# EAGLE design G1-6 (EAGLE 7.6.0)
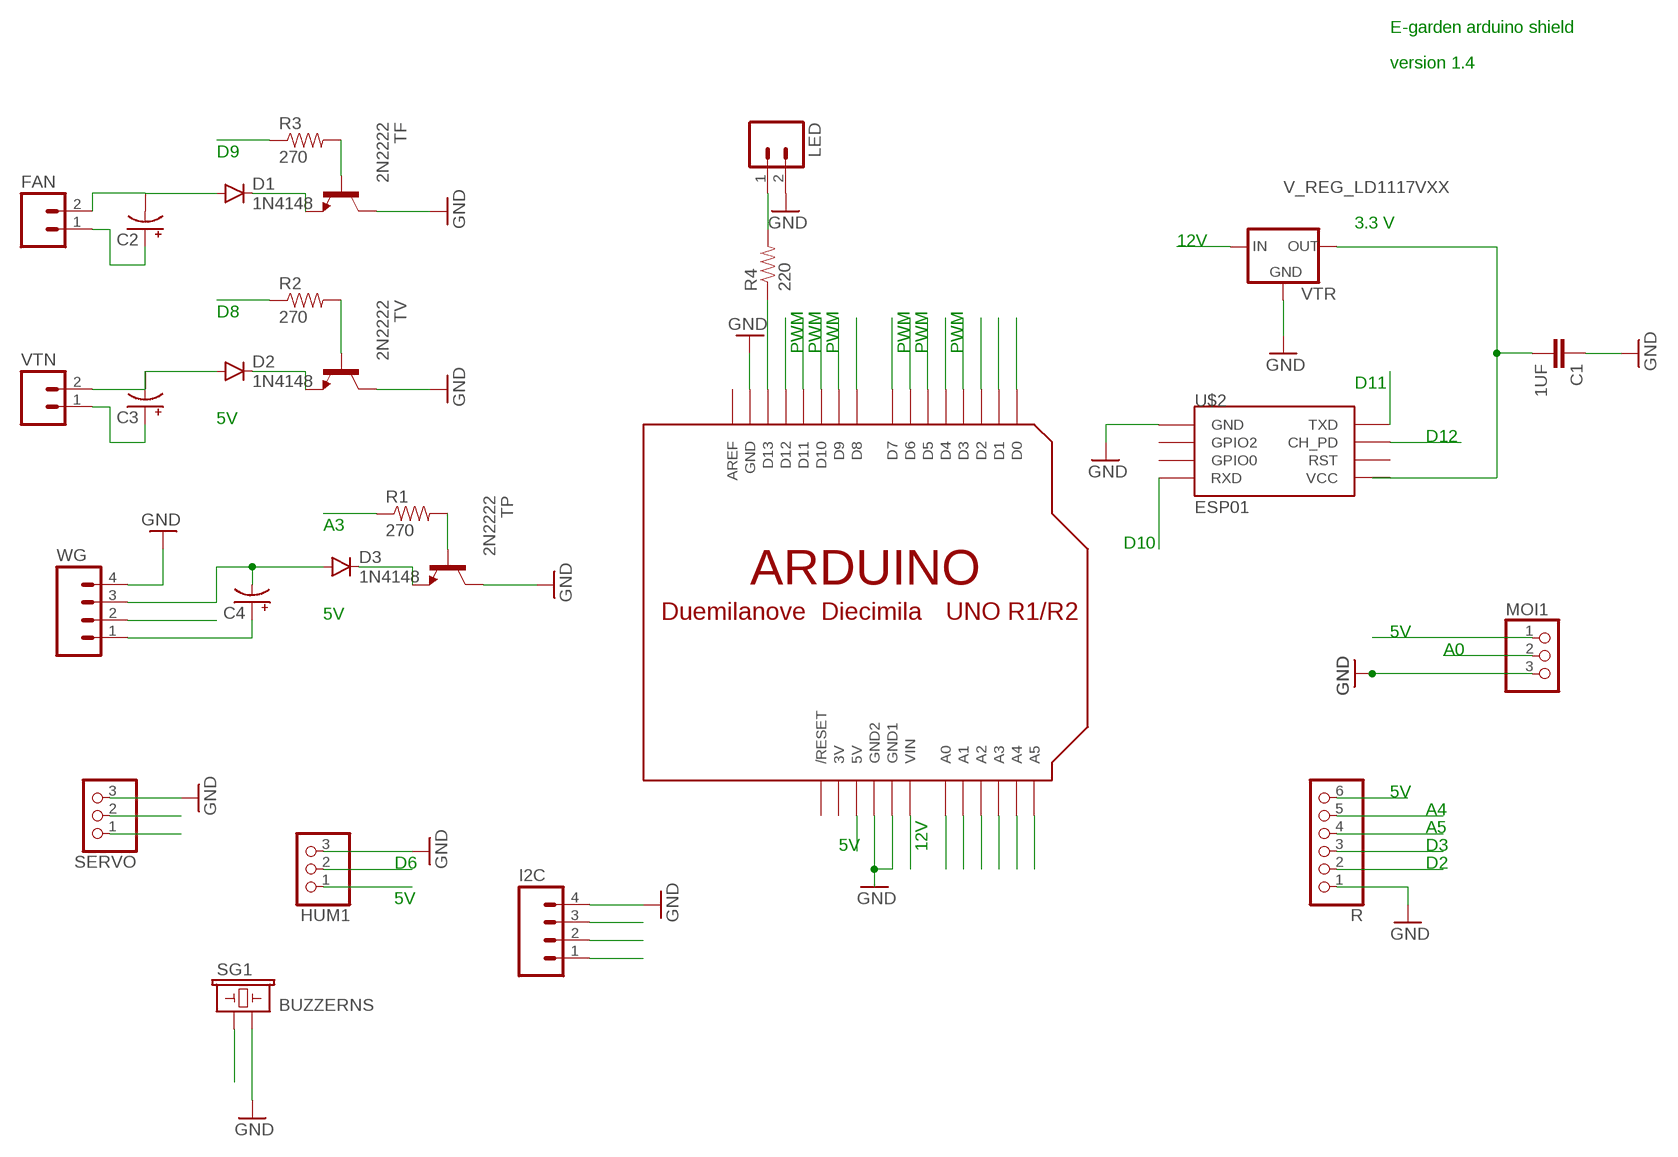
[diagram p0: schematic, sheet 1]

## Parts
C1  1UF  CAPKIT  [CAP-PTH-SMALL-KIT]
C2  CAP_POLPTH2  [CPOL-RADIAL-10UF-25V]
C3  CAP_POLPTH2  [CPOL-RADIAL-10UF-25V]
C4  CAP_POLPTH2  [CPOL-RADIAL-10UF-25V]
D1  1N4148  DIODE1N4148  [DIODE-1N4148]
D2  1N4148  DIODE1N4148  [DIODE-1N4148]
D3  1N4148  DIODE1N4148  [DIODE-1N4148]
FAN  M02PTH  [1X02]
HUM1  PINHD-1X3CB  [1X03-CLEANBIG]
I2C  M04NO_SILK_ALL_ROUND  [1X04_NO_SILK_ALL_ROUND]
LED  M02PTH  [1X02]
MOI1  PINHD-1X3CB  [1X03-CLEANBIG]
R  PINHD-1X6CB  [1X06-CLEANBIG]
R1  270  RESISTORPTH-1/4W  [AXIAL-0.4]
R2  270  RESISTORPTH-1/4W  [AXIAL-0.4]
R3  270  RESISTORPTH-1/4W  [AXIAL-0.4]
R4  220  RESISTORPTH-1/4W  [AXIAL-0.4]
SERVO  PINHD-1X3CB  [1X03-CLEANBIG]
SG1  BUZZERNS  [BUZZER-12MM-NS]
TF  2N2222  [TO92-EBC-OVAL]
TP  2N2222  [TO92-EBC-OVAL]
TV  2N2222  [TO92-EBC-OVAL]
U$1  ARDUINO-BPLACE  [ARDUINO-BPLACE]
U$2  ESP01  [ESP01]
VTN  M02PTH  [1X02]
VTR  V_REG_LD1117VXX  [78XXL]
WG  M04NO_SILK_ALL_ROUND  [1X04_NO_SILK_ALL_ROUND]

## Nets
A0: MOI1.2 U$1.A0
A1: U$1.A1 WG.2
A2: R.4 U$1.A2
A3: R.5 U$1.A3
A4: I2C.3 U$1.A4
A5: I2C.2 U$1.A5
D0: U$1.D0
D1: U$1.D1
D2: R.3 U$1.D2
D3: R.2 U$1.D3
D4: SERVO.2 U$1.D4
D5: SG1.+ U$1.D5
D6: HUM1.2 U$1.D6
D7: R1.P$1 U$1.D7
D8: R2.P$1 U$1.D8
D9: R3.P$1 U$1.D9
D10: U$1.D10 U$2.RX(RXD)
D11: U$1.D11 U$2.TX(TXD)
D12: U$1.D12 U$2.CH_PD
D13: R4.P$1 U$1.D13
GND: C1.1 HUM1.3 I2C.4 LED.2 MOI1.3 R.1 SERVO.3 SG1.- TF.C TP.C TV.C U$1.GND U$1.GND1 U$1.GND2 U$2.GND VTR.IN(GND) WG.4
N$1: D1.C TF.E
N$2: LED.1 R4.P$2
N$3: D2.C TV.E
N$4: D3.C TP.E
N$5: R3.P$2 TF.B
N$6: C3.2(-) D2.A VTN.2
N$7: R1.P$2 TP.B
N$8: C1.2 U$2.VCC VTR.GND(OUT)
N$9: C2.2(-) D1.A FAN.2
N$10: C4.2(-) D3.A WG.3
TV: R2.P$2 TV.B
V5: C2.1(+) C3.1(+) C4.1(+) FAN.1 HUM1.1 I2C.1 MOI1.1 R.6 SERVO.1 U$1.5V VTN.1 WG.1
V12: U$1.VIN VTR.OUT(IN)
Unconnected: U$1.AREF U$1.RESET(/RESET) U$2.GPIO0 U$2.GPIO2 U$2.RST

## Notes on the sheet
- E-garden arduino shield
- version 1.4
- D9
- 3.3 V
- 12V
- D8
- PWM | PWM | PWM | PWM | PWM | PWM
- D11
- 5V
- D12
- A3
- D10
- 5V
- 5V
- A0
- 5V
- A4
- A5
- 5V | 12V | D3
- D6 | D2
- 5V

## Power pins joined to a net without a drawn wire
3V: U$1.3V

## Library data of the parts
C1 = SparkFun-Capacitors:CAP: Capacitor Standard 0603 ceramic capacitor, and 0.1" leaded capacitor.
C2-C4 = SparkFun-Passives:CAP_POL: Capacitor Polarized These are standard SMD and PTH capacitors. Normally 10uF, 47uF, and 100uF in electrolytic and tantalum varieties. Always verify the external diameter of the through hole cap, it varies with capacity, voltage, and manufacturer. The EIA devices should be standard.
D1-D3 = SparkFun-DiscreteSemi:DIODE: Diode These are standard reverse protection diodes and small signal diodes. SMA package can handle up to about 1A. SOD-323 can handle about 200mA. What the SOD-323 package when ordering, there are some mfgs out there that are 5-pin packages.; PROD_ID: DIO-08378
FAN LED VTN = SparkFun-Connectors:M02: Standard 2-pin 0.1" header. Use with - straight break away headers ( PRT-00116) - right angle break away headers (PRT-00553) - swiss pins (PRT-00743) - machine pins (PRT-00117) - female headers (PRT-00115) Molex polarized connector foot print use with: PRT-08233 with associated crimp pins and housings. 2.54_SCREWTERM for use with PRT-10571. 3.5mm Screw Terminal footprints for PRT-08084 5mm Screw Terminal footprints for use with PRT-08432
HUM1 MOI1 SERVO = adafruit:PINHD-1X3: PIN HEADER
I2C WG = SparkFun-Connectors:M04: Header 4 Standard 4-pin 0.1" header. Use with straight break away headers (SKU : PRT-00116), right angle break away headers (PRT-00553), swiss pins (PRT-00743), machine pins (PRT-00117), and female headers (PRT-00115). Molex polarized connector foot print use with SKU : PRT-08231 with associated crimp pins and housings. 1MM SMD Version SKU: PRT-10208; PROD_ID: CONN-09696
R = adafruit:PINHD-1X6: PIN HEADER
R1-R4 = SparkFun-Passives:RESISTOR: Resistor Basic schematic elements and footprints for 0603, 1206, and PTH resistors.
SG1 = SparkFun-Electromechanical:BUZZER: Buzzer 12mm Spark Fun Electronics SKU : Comp-Buzzer
TF TP TV = adafruit:2N2222: NPN TRANSISTOR Big oval pads
U$1 = adafruit:ARDUINO: Arduino Diecimila/Duemilanove Make a shield with ease, this package has all the named pins as well as the two mounting drill holes and an outline of the USB and DC power connector. The outline is on the DIMENSION layer, so if your board house uses it they will cut the outline to match. http://www.ladyada.net/library/pcb/eaglelibrary.html
U$2 = esp8266modules:ESP01: ESP8266 Wifi module 01
VTR = SparkFun-PowerIC:V_REG_LD1117VXX: LD1117VXX voltage regulator. We carry the 3.3V version (COM-00526) in TO-220 package.

## Board
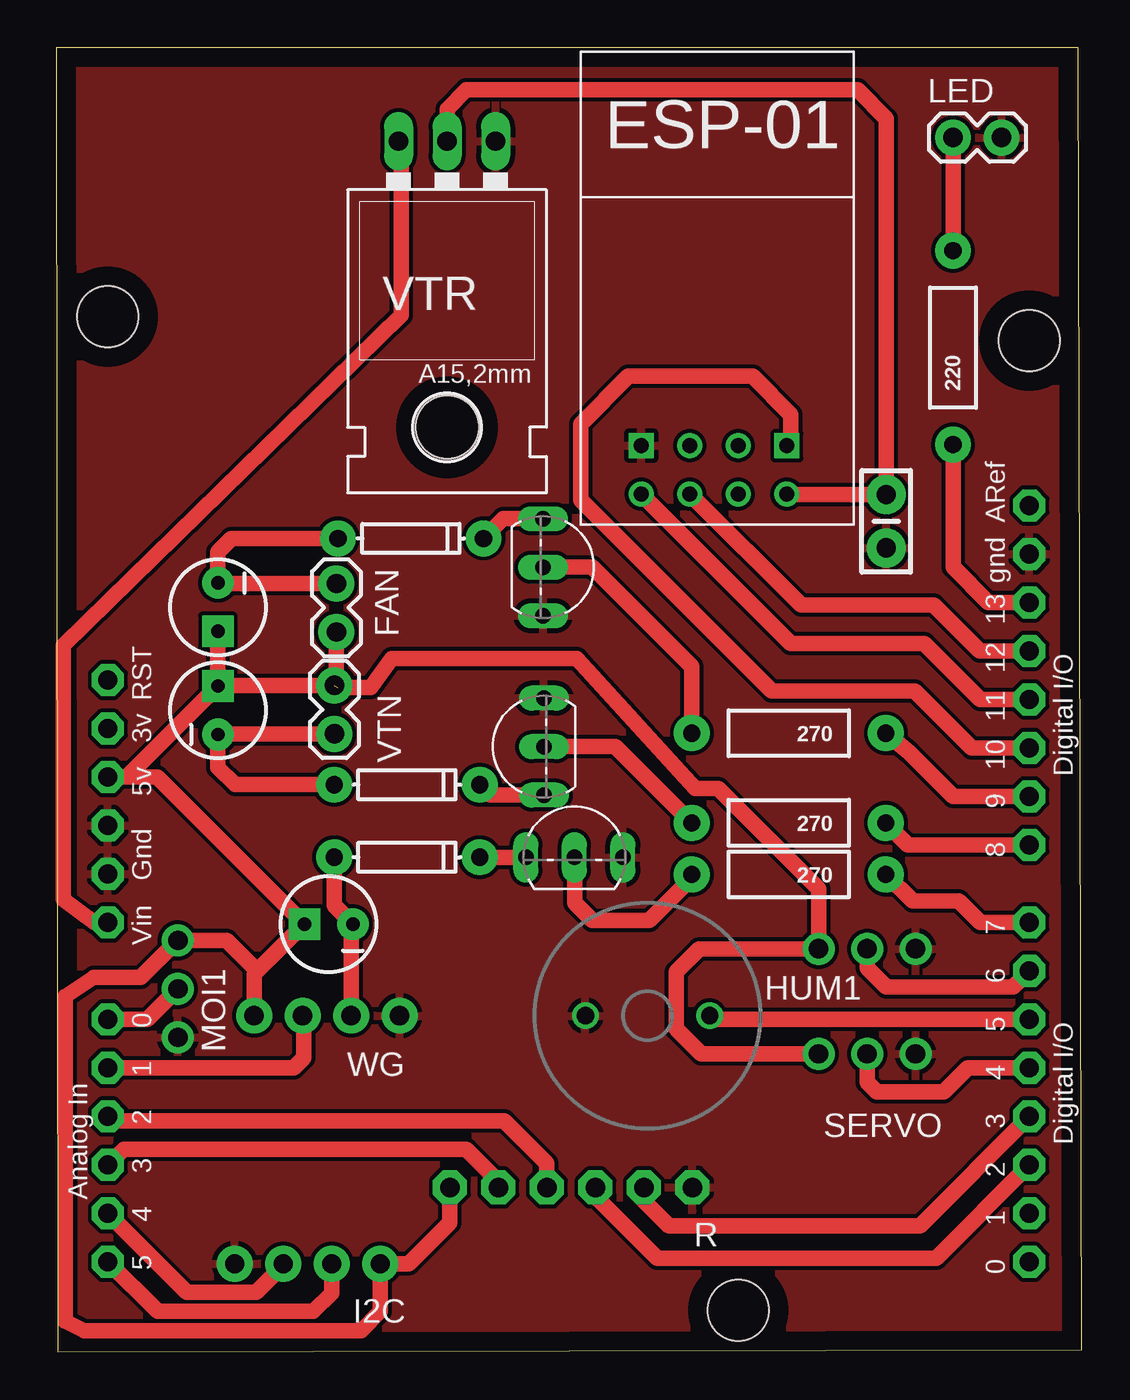
[diagram p1: board, top side]
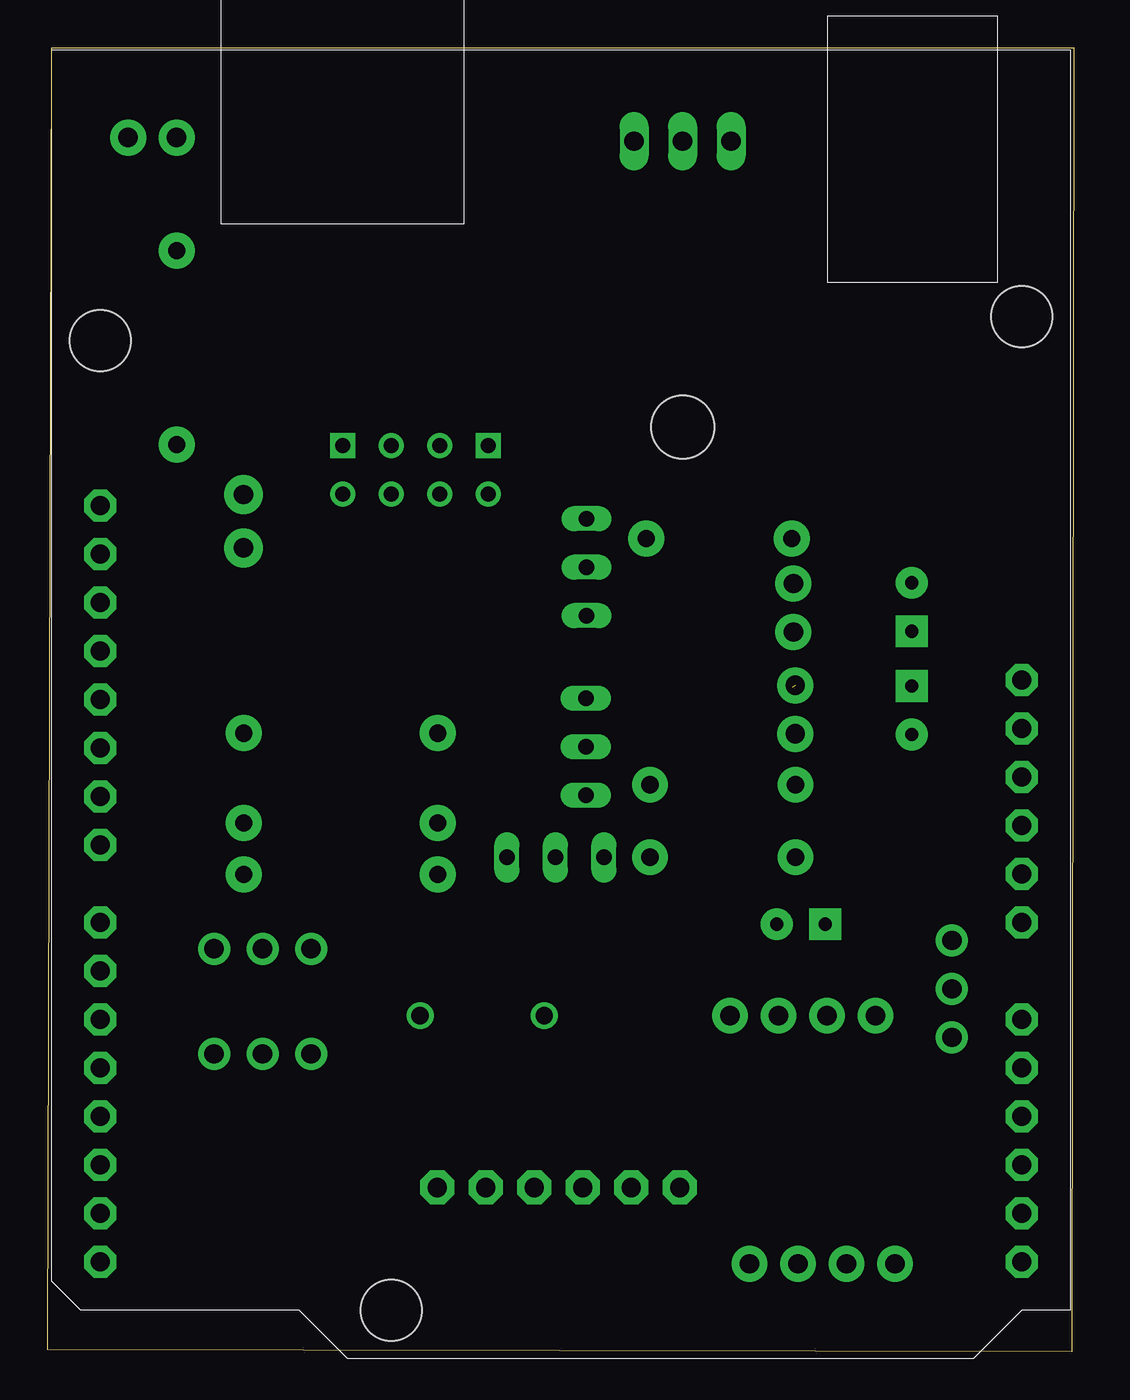
[diagram p2: board, bottom side, seen from below]

Size 53.73 x 68.32 mm. Coordinates in mm from the lower left corner, seen from the top.
Outline: 0.1,0 53.73,0.1 53.53,68.32 0,68.32 0.1,0
Copper layers (1*16): Top 0.035mm / dielectric 1.5mm / Bottom 0.035mm
Design rules "default": minimum track width 10mil, minimum drill 24mil, track to track 8mil, track to pad 8mil, pad to pad 8mil, via to via 8mil, smd to smd 8mil, copper to edge 40mil, drill to drill 8mil, minimum pad ring 10mil, minimum via ring 8mil, stop-mask expansion 4mil, vias tented up to drill 0mil, thermal gap 10mil

### Footprints (pad centres in the part's own frame; a part is rotated, then mirrored left to right if it is on the bottom)
CAP-PTH-SMALL-KIT = drill 1.016 pad 2.032: 1 -1.397,0; 2 1.397,0
CPOL-RADIAL-10UF-25V = drill 0.7 pad 1.651 square: 1 1.27,0 | drill 0.7 pad 1.651: 2 -1.27,0
DIODE-1N4148 = drill 0.9 pad 1.88: A -3.81,0; C 3.81,0
1X02 = drill 1.016 pad 1.88: 1 0,0; 2 2.54,0
1X03-CLEANBIG = drill 1.016 pad 1.676: 1 -2.54,0; 2 0,0; 3 2.54,0
1X04_NO_SILK_ALL_ROUND = drill 1.016 pad 1.88: 1 0,0; 2 2.54,0; 3 5.08,0; 4 7.62,0
1X06-CLEANBIG = drill 1.016 pad 1.778 octagon: 1 -6.35,0; 2 -3.81,0; 3 -1.27,0; 4 1.27,0; 5 3.81,0; 6 6.35,0
AXIAL-0.4 = drill 0.9 pad 1.88: P$1 -5.08,0; P$2 5.08,0
BUZZER-12MM-NS = drill 0.9: + 3.25,0; - -3.25,0
TO92-EBC-OVAL = drill 0.813 long: B 0,-1.27; C 2.54,-1.27; E -2.54,-1.27
ARDUINO-BPLACE = drill 1 pad 1.676 octagon: 3V 35.56,2.54; 5V 38.1,2.54; A0 50.8,2.54; A1 53.34,2.54; A2 55.88,2.54; A3 58.42,2.54; A4 60.96,2.54; A5 63.5,2.54; AREF 23.876,50.8; D0 63.5,50.8; D1 60.96,50.8; D2 58.42,50.8; D3 55.88,50.8; D4 53.34,50.8; D5 50.8,50.8; D6 48.26,50.8; D7 45.72,50.8; D8 41.656,50.8; D9 39.116,50.8; D10 36.576,50.8; D11 34.036,50.8; D12 31.496,50.8; D13 28.956,50.8; GND 26.416,50.8; GND1 43.18,2.54; GND2 40.64,2.54; RESET 33.02,2.54; VIN 45.72,2.54 | hole 3.2: 15.24,50.8; 66.04,35.56; 13.97,2.54
ESP01 = drill 0.8: CH_PD -1.285,-8.178; GPIO0 1.255,-5.638; GPIO2 -1.285,-5.638; RST 1.255,-8.178; TX -3.825,-8.178; VCC 3.795,-8.178 | drill 0.8 square: GND -3.825,-5.638; RX 3.795,-5.638
78XXL = drill 1.016 long: GND 0,-3.81; IN -2.54,-3.81; OUT 2.54,-3.81 | hole 3.302: 0,11.176

### Placement (x,y rotation side)
C1  43.48,43.51 90 top
C2  8.48,39.01 270 top
C3  8.48,33.61 90 top
C4  14.28,22.41 180 top
D1  18.58,42.61 0 top
D2  18.38,29.71 0 top
D3  18.38,25.91 0 top
FAN  14.68,37.71 90 top
HUM1  42.48,21.11 0 top
I2C  16.98,4.61 180 top
LED  46.98,63.61 0 top
MOI1  6.38,19.01 270 top
R  26.98,8.61 180 top
R1  38.38,25.01 180 top
R2  38.38,27.71 180 top
R3  38.38,32.41 180 top
R4  46.98,52.61 90 top
SERVO  42.48,15.61 0 top
SG1  30.98,17.61 0 top
TF  26.78,41.11 270 top
TP  27.15,27.17 0 top
TV  24.28,31.71 90 top
U$1  0.18,68.21 270 top
U$2  34.48,53.11 0 top
VTN  14.58,34.91 270 top
VTR  20.48,59.61 180 top
WG  10.38,17.61 0 top

### Tracks (layer width: path | path; a pad name or v marks a point on that pad's centre or on a via)
A0
  Top 0.813: U$1.A0 4.78,17.41 MOI1.2
A1
  Top 0.813: U$1.A1 12.44,14.87 12.98,15.41 12.98,17.55 WG.2
A2
  Top 0.813: U$1.A2 2.94,12.11 23.48,12.11 25.71,9.88 R.4
A3
  Top 0.813: U$1.A3 3.54,10.61 21.48,10.61 23.17,8.92 R.5
A4
  Top 0.813: U$1.A4 6.86,3.11 10.48,3.11 11.9,4.53 I2C.3
A5
  Top 0.813: U$1.A5 5.32,2.11 13.48,2.11 14.44,3.07 I2C.2
D2
  Top 0.813: U$1.D2 46.1,4.91 31.48,4.91 28.25,8.14 R.3
D3
  Top 0.813: U$1.D3 45.26,6.61 32.08,6.61 30.79,7.9 R.2
D4
  Top 0.813: U$1.D4 47.74,14.87 46.48,13.61 42.98,13.61 42.48,14.11 SERVO.2
D5
  Top 0.813: U$1.D5 34.23,17.41 SG1.+
D6
  Top 0.813: U$1.D6 50.14,19.11 43.48,19.11 42.48,20.11 HUM1.2
D7
  Top 0.813: U$1.D7 48.4,22.49 47.28,23.61 44.86,23.61 R1.P$1
D8
  Top 0.813: U$1.D8 44.62,26.55 R2.P$1
D9
  Top 0.813: U$1.D9 47,29.09 44.68,31.41 R3.P$1
D10
  Top 0.813: U$1.D10 47.96,31.63 44.98,34.61 37.48,34.61 27.48,44.61 27.48,48.61 29.98,51.11 36.48,51.11 38.48,49.11 38.48,47.68 U$2.RX
D11
  Top 0.813: U$1.D11 48.42,34.17 45.48,37.11 38.48,37.11 U$2.TX
D12
  Top 0.813: U$1.D12 48.38,36.71 45.98,39.11 39.02,39.11 U$2.CH_PD
D13
  Top 0.813: U$1.D13 48.84,39.25 46.98,41.11 R4.P$1
GND
  pour Top: 0.18,68.11 53.68,68.21 53.68,0.11 0.08,0.11
N$1
  Top 0.813: TF.E 23.43,43.65 D1.C
N$2
  Top 0.813: R4.P$2 LED.1
N$3
  Top 0.813: TV.E 22.73,29.17 D2.C
N$4
  Top 0.813: TP.E 23.58,25.9 D3.C
N$5
  Top 0.813: R3.P$2 33.3,35.89 28.08,41.11 TF.B
N$6
  Top 0.813: VTN.2 8.51,32.37 C3.2 8.48,30.61 9.38,29.71 D2.A
N$7
  Top 0.813: R1.P$2 33.3,24.83 31.08,22.61 28.08,22.61 27.18,23.51 27.18,25.87 TP.B
N$8
  Top 0.813: VTR.GND 20.48,65.11 21.48,66.11 41.98,66.11 43.48,64.61 C1.2 38.3,44.91 U$2.VCC
N$9
  Top 0.813: 14.77,40.34 FAN.2 8.51,40.25 C2.2 8.48,41.91 9.18,42.61 D1.A
N$10
  Top 0.813: WG.3 15.46,22.32 C4.2 14.57,23.39 D3.A
TV
  Top 0.813: R2.P$2 29.3,31.71 TV.B
V5  (1 unrouted)
  Top 0.813: R.6 20.63,6.76 18.48,4.61 I2C.1 16.98,2.11 15.98,1.11 1.48,1.11 0.48,1.61 0.48,18.61 1.98,19.61 4.44,19.61 MOI1.1 8.94,21.55 10.54,19.95 | 2.72,30.35 U$1.5V | WG.1 10.38,19.78 10.54,19.95 | 10.54,19.95 C4.1 5.31,30.11 U$1.5V | 14.75,34.81 16.48,34.81 17.58,36.31 27.28,36.31 33.48,29.51 34.68,29.51 39.94,24.25 HUM1.1 33.68,21.11 32.48,19.91 32.48,16.91 33.78,15.61 SERVO.1 | U$1.5V 3.71,30.11 C3.1 8.51,34.91 8.68,34.91 | 8.68,34.91 VTN.1 14.68,35.01 FAN.1 | 8.68,34.91 8.48,35.11 C2.1
V12
  Top 0.813: U$1.VIN 2,22.49 0.38,23.71 0.38,37.01 18.08,54.31 18.08,63.28 VTR.OUT